# Altium schematic sheet Open Reactor Control System - Power Supplies.SchDoc: ORC - Power Supplies
size A3; Author: Peake J; CompanyName: Scion Research; DrawnBy: Peake J; Engineer: Peake J; Organization: Scion; Address1: 49 Sala St; Address2: Whakarewarewa; Address3: Rotorua; Address4: New Zealand 3010; DocumentNumber: 0-2; Revision: 2; SheetNumber: 1; SheetTotal: 5
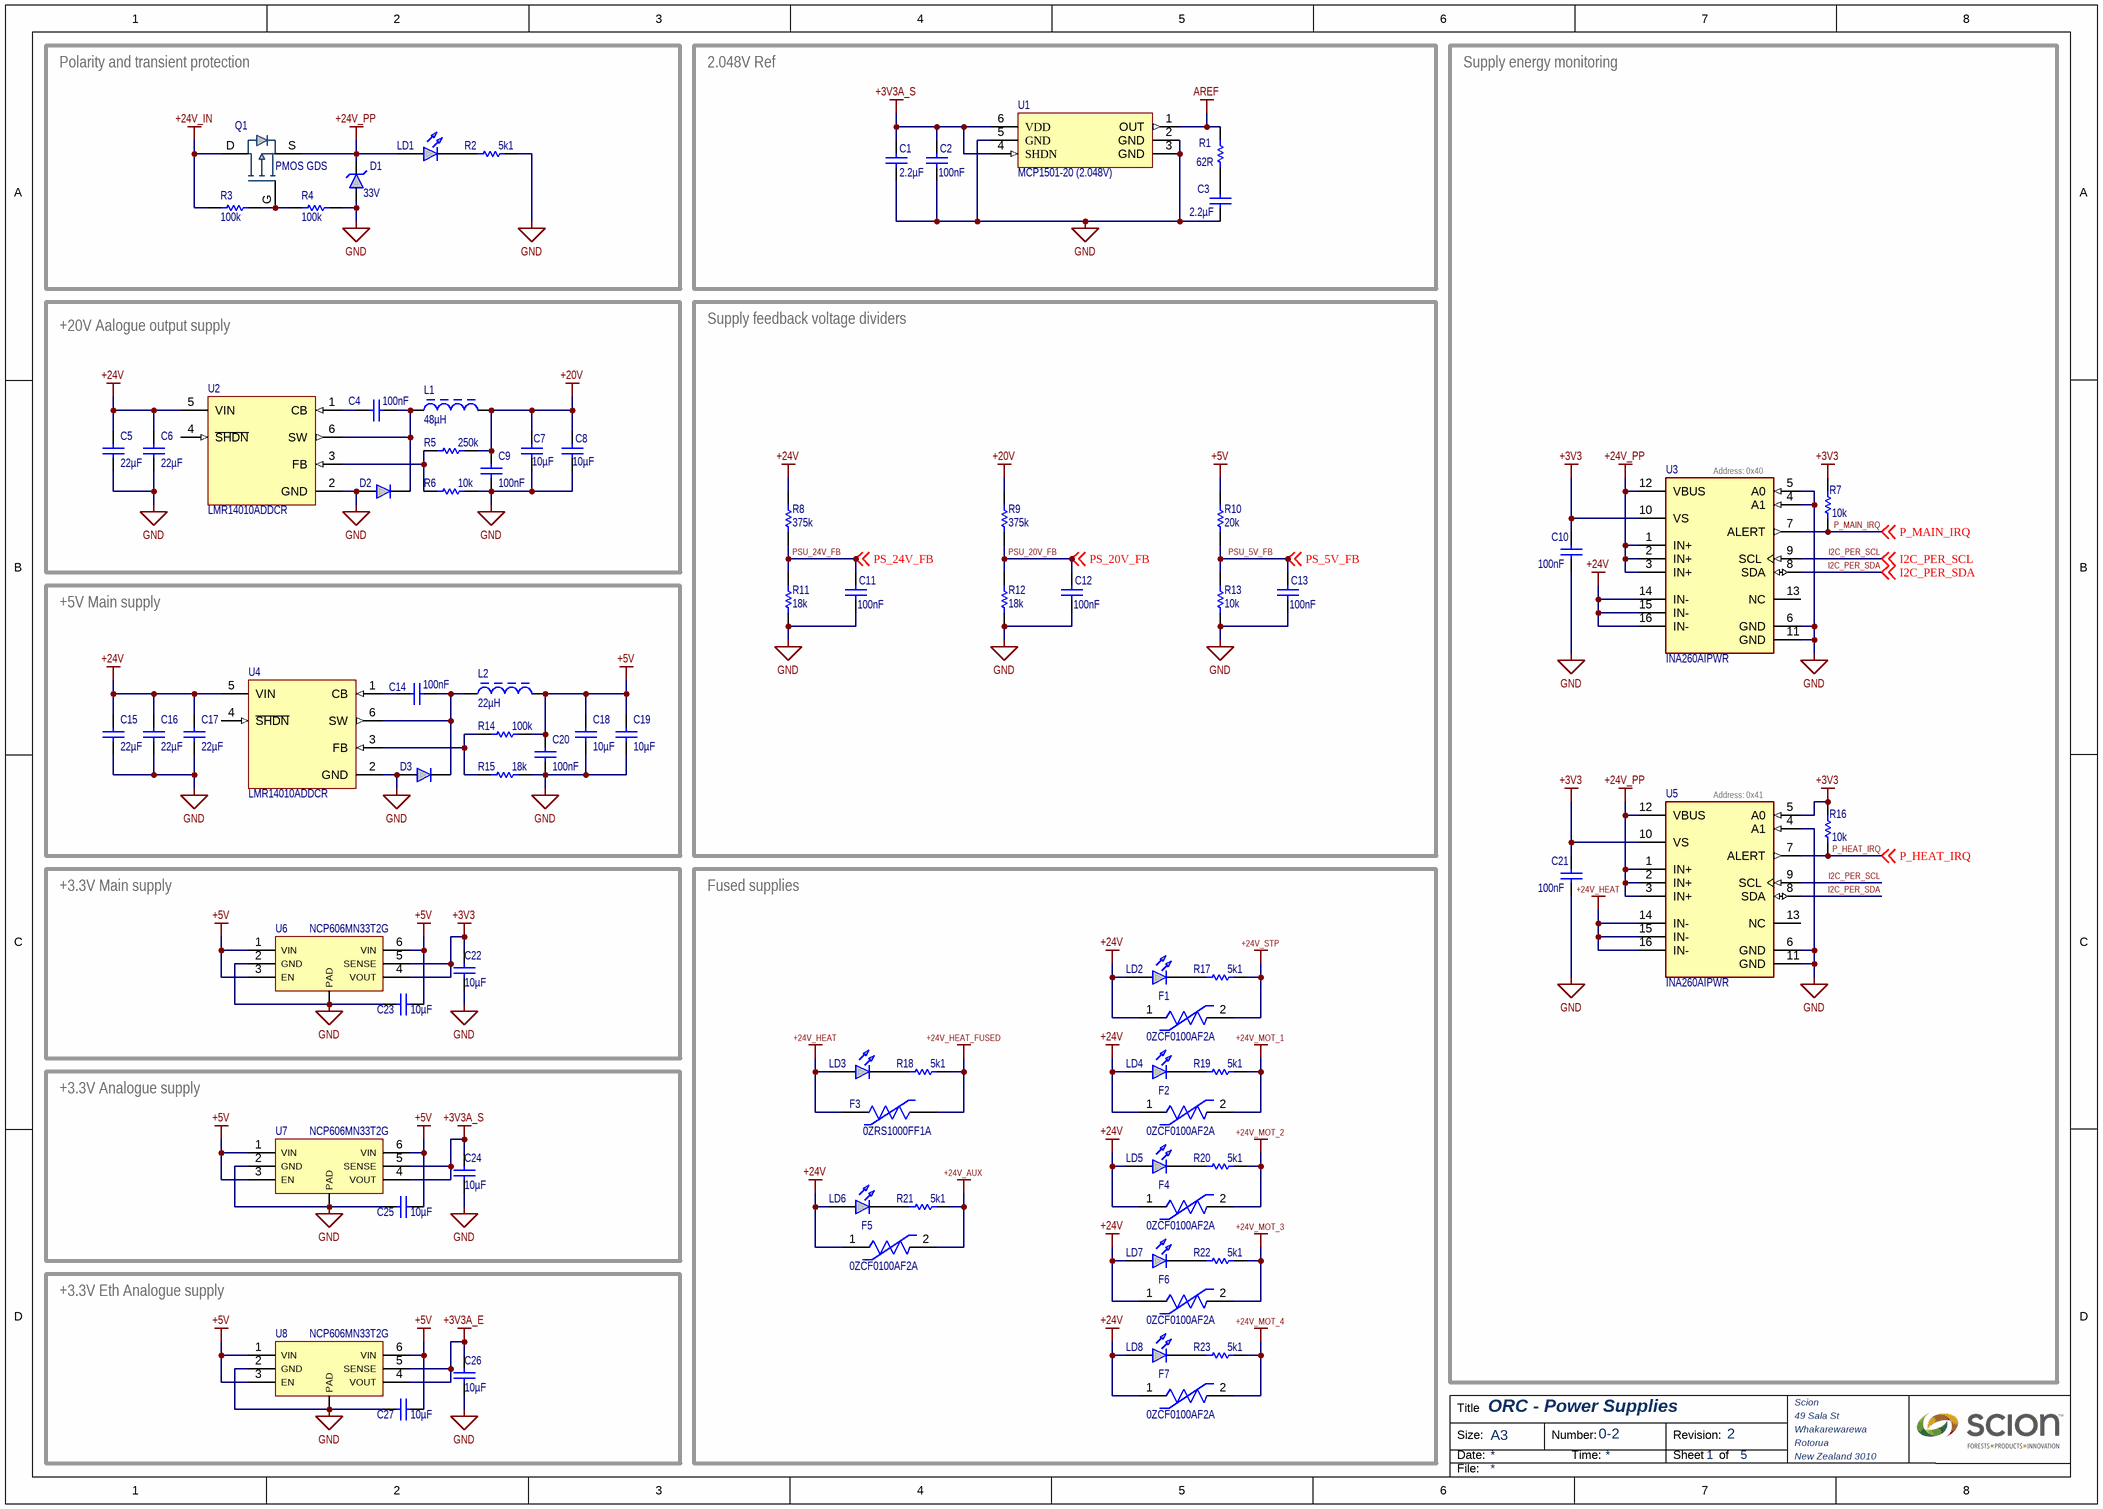
[diagram p0: Open Reactor Control System - Power Supplies.SchDoc]

## Parts
C1  value 2.2µF  [0603_CAP]  (hidden comment: Capacitor)
C2  value 100nF  [0603_CAP]  (hidden comment: Capacitor)
C3  value 2.2µF  [0603_CAP]  (hidden comment: Capacitor)
C4  value 100nF  [0603_CAP]  (hidden comment: Capacitor)
C5  value 22µF  [1206_CAP]  (hidden comment: Capacitor)
C6  value 22µF  [1206_CAP]  (hidden comment: Capacitor)
C7  value 10µF  [1206_CAP]  (hidden comment: Capacitor)
C8  value 10µF  [1206_CAP]  (hidden comment: Capacitor)
C9  value 100nF  [0603_CAP]  (hidden comment: Capacitor)
C10  value 100nF  [0603_CAP]  (hidden comment: Capacitor)
C11  value 100nF  [0603_CAP]  (hidden comment: Capacitor)
C12  value 100nF  [0603_CAP]  (hidden comment: Capacitor)
C13  value 100nF  [0603_CAP]  (hidden comment: Capacitor)
C14  value 100nF  [0603_CAP]  (hidden comment: Capacitor)
C15  value 22µF  [1206_CAP]  (hidden comment: Capacitor)
C16  value 22µF  [1206_CAP]  (hidden comment: Capacitor)
C17  value 22µF  [1206_CAP]  (hidden comment: Capacitor)
C18  value 10µF  [0603_CAP]  (hidden comment: Capacitor)
C19  value 10µF  [0603_CAP]  (hidden comment: Capacitor)
C20  value 100nF  [0603_CAP]  (hidden comment: Capacitor)
C21  value 100nF  [0603_CAP]  (hidden comment: Capacitor)
C22  value 10µF  [0603_CAP]  (hidden comment: Capacitor)
C23  value 10µF  [0603_CAP]  (hidden comment: Capacitor)
C24  value 10µF  [0603_CAP]  (hidden comment: Capacitor)
C25  value 10µF  [0603_CAP]  (hidden comment: Capacitor)
C26  value 10µF  [0603_CAP]  (hidden comment: Capacitor)
C27  value 10µF  [0603_CAP]  (hidden comment: Capacitor)
D1  Rated Voltage: 33V  [SMBJ]  (hidden comment: Transil)
D2  Diode  [SOD-123]  (value not drawn)
D3  Diode  [SOD-123]  (value not drawn)
F1  0ZCF0100AF2A  [FP-0ZCF0100AF2A-MFG]
F2  0ZCF0100AF2A  [FP-0ZCF0100AF2A-MFG]
F3  0ZRS1000FF1A  [0ZRS1000FF1A-flat]
F4  0ZCF0100AF2A  [FP-0ZCF0100AF2A-MFG]
F5  0ZCF0100AF2A  [FP-0ZCF0100AF2A-MFG]
F6  0ZCF0100AF2A  [FP-0ZCF0100AF2A-MFG]
F7  0ZCF0100AF2A  [FP-0ZCF0100AF2A-MFG]
L1  value 48µH  [SRR1206]  (hidden comment: Inductor)
L2  value 22µH  [BOUR-SRN8040_V]  (hidden comment: Inductor)
LD1  LED  [0805]  (value not drawn)
LD2  LED  [0805]  (value not drawn)
LD3  LED  [0805]  (value not drawn)
LD4  LED  [0805]  (value not drawn)
LD5  LED  [0805]  (value not drawn)
LD6  LED  [0805]  (value not drawn)
LD7  LED  [0805]  (value not drawn)
LD8  LED  [0805]  (value not drawn)
Q1  PMOS GDS  [PowerDI 5060-8]
R1  value 62R  [0603_RES]  (hidden comment: Resistor)
R2  value 5k1  [0603_RES]  (hidden comment: Resistor)
R3  value 100k  [0603_RES]  (hidden comment: Resistor)
R4  value 100k  [0603_RES]  (hidden comment: Resistor)
R5  value 250k  [0603_RES]  (hidden comment: Resistor)
R6  value 10k  [0603_RES]  (hidden comment: Resistor)
R7  value 10k  [0603_RES]  (hidden comment: Resistor)
R8  value 375k  [0603_RES]  (hidden comment: Resistor)
R9  value 375k  [0603_RES]  (hidden comment: Resistor)
R10  value 20k  [0603_RES]  (hidden comment: Resistor)
R11  value 18k  [0603_RES]  (hidden comment: Resistor)
R12  value 18k  [0603_RES]  (hidden comment: Resistor)
R13  value 10k  [0603_RES]  (hidden comment: Resistor)
R14  value 100k  [0603_RES]  (hidden comment: Resistor)
R15  value 18k  [0603_RES]  (hidden comment: Resistor)
R16  value 10k  [0603_RES]  (hidden comment: Resistor)
R17  value 5k1  [0603_RES]  (hidden comment: Resistor)
R18  value 5k1  [0603_RES]  (hidden comment: Resistor)
R19  value 5k1  [0603_RES]  (hidden comment: Resistor)
R20  value 5k1  [0603_RES]  (hidden comment: Resistor)
R21  value 5k1  [0603_RES]  (hidden comment: Resistor)
R22  value 5k1  [0603_RES]  (hidden comment: Resistor)
R23  value 5k1  [0603_RES]  (hidden comment: Resistor)
U1  MCP1501-20 (2.048V)  [SOT-6]
U2  LMR14010ADDCR  [FP-DDC0006A-IPC_A]
U3  INA260AIPWR  [FP-PW0016A-IPC_B]
U4  LMR14010ADDCR  [FP-DDC0006A-IPC_A]
U5  INA260AIPWR  [FP-PW0016A-IPC_B]
U6  NCP606MN33T2G  [QFN95P330X295X100_HS-7N]
U7  NCP606MN33T2G  [QFN95P330X295X100_HS-7N]
U8  NCP606MN33T2G  [QFN95P330X295X100_HS-7N]

## Blocks framed on the sheet
Polarity and transient protection: D1 LD1 Q1 R2-R4
2.048V Ref: C1-C3 R1 U1
Supply energy monitoring: C10 C21 R7 R16 U3 U5
+20V Aalogue output supply: C4-C9 D2 L1 R5 R6 U2
Supply feedback voltage dividers: C11-C13 R8-R13
+5V Main supply: C14-C20 D3 L2 R14 R15 U4
+3.3V Main supply: C22 C23 U6
Fused supplies: F1-F7 LD2-LD8 R17-R23
+3.3V Analogue supply: C24 C25 U7
+3.3V Eth Analogue supply: C26 C27 U8

## Nets
+3V3: C10.1 C21.1 C22.1 R7.1 R16.1 U3.10(VS) U5.5(A0) U5.10(VS) U6.4(VOUT) U6.5(SENSE)
+3V3A_E: C26.1 U8.4(VOUT) U8.5(SENSE)
+3V3A_S: C1.1 C2.1 C24.1 U1.4(SHDN) U1.6(VDD) U7.4(VOUT) U7.5(SENSE)
+5V: C18.1 C19.1 C20.1 C23.1 C25.1 C27.1 L2.2 R10.1 R14.2 U6.1(VIN) U6.3(EN) U6.6(VIN) U7.1(VIN) U7.3(EN) U7.6(VIN) U8.1(VIN) U8.3(EN) U8.6(VIN)
+20V: C7.1 C8.1 C9.1 L1.2 R5.2 R9.1
+24V: C5.1 C6.1 C15.1 C16.1 C17.1 F1.1 F2.1 F4.1 F5.1 F6.1 F7.1 LD2.2(A) LD4.2(A) LD5.2(A) LD6.2(A) LD7.2(A) LD8.2(A) R8.1 U2.5(VIN) U3.14(IN-) U3.15(IN-) U3.16(IN-) U4.5(VIN)
+24V_AUX: F5.2 R21.2
+24V_HEAT: F3.1 LD3.2(A) U5.14(IN-) U5.15(IN-) U5.16(IN-)
+24V_HEAT_FUSED: F3.2 R18.2
+24V_IN: Q1.D R3.1
+24V_MOT_1: F2.2 R19.2
+24V_MOT_2: F4.2 R20.2
+24V_MOT_3: F6.2 R22.2
+24V_MOT_4: F7.2 R23.2
+24V_PP: D1.2(K) LD1.2(A) Q1.S U3.1(IN+) U3.2(IN+) U3.3(IN+) U3.12(VBUS) U5.1(IN+) U5.2(IN+) U5.3(IN+) U5.12(VBUS)
+24V_STP: F1.2 R17.2
AREF: R1.1 U1.1(OUT)
GND: C1.2 C2.2 C3.1 C5.2 C6.2 C7.2 C8.2 C9.2 C10.2 C11.2 C12.2 C13.2 C15.2 C16.2 C17.2 C18.2 C19.2 C20.2 C21.2 C22.2 C23.2 C24.2 C25.2 C26.2 C27.2 D1.1(A) D2.2(A) D3.2(A) R2.2 R4.2 R6.2 R11.1 R12.1 R13.1 R15.2 U1.2(GND) U1.3(GND) U1.5(GND) U2.2(GND) U3.4(A1) U3.5(A0) U3.6(GND) U3.11(GND) U4.2(GND) U5.4(A1) U5.6(GND) U5.11(GND) U6.2(GND) U6.PAD U7.2(GND) U7.PAD U8.2(GND) U8.PAD
I2C_PER_SCL: U3.9(SCL) U5.9(SCL) ; off-sheet I2C_PER_SCL
I2C_PER_SDA: U3.8(SDA) U5.8(SDA) ; off-sheet I2C_PER_SDA
P_HEAT_IRQ: R16.2 U5.7(ALERT) ; off-sheet P_HEAT_IRQ
P_MAIN_IRQ: R7.2 U3.7(ALERT) ; off-sheet P_MAIN_IRQ
PSU_5V_FB: C13.1 R10.2 R13.2 ; off-sheet PS_5V_FB  [also labelled PS_5V_FB]
PSU_20V_FB: C12.1 R9.2 R12.2 ; off-sheet PS_20V_FB  [also labelled PS_20V_FB]
PSU_24V_FB: C11.1 R8.2 R11.2 ; off-sheet PS_24V_FB  [also labelled PS_24V_FB]
NetC3_2: C3.2 R1.2
NetC4_1: C4.1 D2.1(K) L1.1 U2.6(SW)
NetC4_2: C4.2 U2.1(CB)
NetC14_1: C14.1 D3.1(K) L2.1 U4.6(SW)
NetC14_2: C14.2 U4.1(CB)
NetLD1_1: LD1.1(K) R2.1
NetLD2_1: LD2.1(K) R17.1
NetLD3_1: LD3.1(K) R18.1
NetLD4_1: LD4.1(K) R19.1
NetLD5_1: LD5.1(K) R20.1
NetLD6_1: LD6.1(K) R21.1
NetLD7_1: LD7.1(K) R22.1
NetLD8_1: LD8.1(K) R23.1
NetQ1_G: Q1.G R3.2 R4.1
NetR5_1: R5.1 R6.1 U2.3(FB)
NetR14_1: R14.1 R15.1 U4.3(FB)

Not connected (* = marked no-connect by the designer): U2 4(~{SHDN}); U3 13(NC); U4 4(~{SHDN}); U5 13(NC)

## Notes on the sheet
- (near U3) Address: 0x40
- (near U5) Address: 0x41
- Title
- Size:
- Date:
- A3
- Number:
- Time:
- Revision:
- Sheet
- of
- File:

## Library data of the parts
C1-C27 = CMP-001-00172-2: SMD Capacitor; Pins: 2; Source: Discrete.SchLib; Design Item ID: Capacitor; Component Type: Standard
D1 = CMP-079-000108-2: Transient Voltage Suppressor; MFN: SMBJ33A; Component Type: Standard; Pin Count: 2; Source: Discrete.SchLib; Breakdown Voltage: *; Design Item ID: Transil; Clamping Voltage: *
D2 D3 = CMP-004-00083-4: SMD Diode; Design Item ID: Diode; Pins: 2; Source: Discrete.SchLib; Component Type: Standard; Pin Count: 2
F1 F2 F4-F7 = CMP-005-00014-2: PTC Resettable Fuse 100A 0.5s 60VDC 0.09 Ohm 2-Pin 2920 T/R; Time to Trip: 500ms; Hold Current: 1A; Trip Current: 2A; Pins: 2; Component Type: Standard; Thickness: 0.067inch; Width: 0.202inch; Series: 0ZCF; Max Operating Temperature: 85°C; Source: All Components - 30.06.23 - 18.27.SchLib; Min Operating Temperature: -40°C; Design Item ID: CMP-00051-1; Length: 0.29inch; Case/Package: 2920; RoHS Compliant: Yes; Packaging: Cut Tape; Max Current Rating: 100A; Case Code (Metric): 7351; Mount: Surface Mount
F3 = CMP-005-00013-5: PTC Resettable Fuse 10A(hold) 20A(trip) 32VDC 100A 7W 15s 0.006Ohm Radial 23.5 X 4 X 27.9mm Box; Mount: Through Hole; Source: All Components - 30.06.23 - 18.27.SchLib; Trip Current: 20A; Component Type: Standard; Hold Current: 10A; Case/Package: Radial; Series: 0ZRS; Ratings: AEC-Q200; Time to Trip: 15s; Design Item ID: CMP-00049-1; Max Current Rating: 100A; Min Operating Temperature: -40°C; Pins: 2; Max Operating Temperature: 125°C
L1 L2 = CMP-006-00052-2: Power Inductor; DCR: 100mR; Current Rating: 2.2A; Pins: 2; Component Type: Standard; Design Item ID: Inductor; Source: Discrete.SchLib; Pin Count: 2; MFN: *
LD1-LD8 = CMP-004-00084-3: SMD LED; Colour: RED; Pins: 2; Source: Discrete.SchLib; Design Item ID: LED; Component Type: Standard; Pin Count: 2
Q1 = CMP-079-000102-2: P Channel MOSFET; MFN: *; Design Item ID: PMOS GDS; VGS Max: *; Continuous Current: *; VDS Breakdown: *; Source: P-MOS.SchLib; Component Type: Standard; Pin Count: 3
R1-R23 = CMP-009-00356-1: SMD Resistor; Pins: 2; Source: Discrete.SchLib; Component Type: Standard; Design Item ID: Resistor
U1 = CMP-079-000089-1: Voltage Reference; Pin Count: 6; Source: Microchip.SchLib; Component Type: Standard; Design Item ID: MCP1501
U2 U4 = CMP-079-000005-5: 7-40VDC-DC buck converter; Number of Outputs: 1; Max Output Voltage: 40V; Output Current: 1A; Min Input Voltage: 4V; Output Type: Adjustable; Synchronous Rectifier: No; Min Output Voltage: 765mV; Output Configuration: Positive; Switching Frequency: 850kHz; Max Operating Temperature: 125°C; Case/Package: SOT-23-6; Features: UVLO; Pin Count: 6; Packaging: Cut Tape; Mount: Surface Mount; Component Type: Standard; Min Operating Temperature: -40°C; Max Input Voltage: 40V; Source: All Components - 30.06.23 - 18.27.SchLib; Design Item ID: CMP-00007-1
U3 U5 = CMP-010-00002-1: Operational Amplifier, 1 Func, 7500uV Offset-Max, PDSO16; Max Supply Voltage: 5.5V; Nominal Supply Voltage: 3.3V; Min Supply Voltage: 2.7V; Case/Package: TSSOP; RoHS Compliant: Yes; Pins: 16; Max Operating Temperature: 125°C; Min Operating Temperature: -40°C
U6-U8 = CMP-019-00001-1: Fixed Positive LDO Regulator, 3.3V, 0.22V Dropout, CMOS; Max Supply Voltage: 6V; RoHS Compliant: Yes; Case/Package: HVSON; Pins: 6